# Altium project Amplificador.PrjPcb
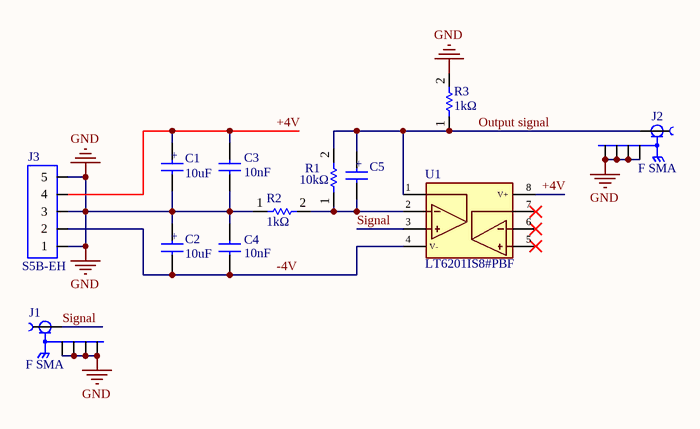
[diagram p0: Amplificador.SchDoc]
1 sheet, 12 parts. Net scope: global (net labels, ports and power ports of the same name join across sheets).
Board file: Amplificador.PcbDoc

## Sheet Amplificador.SchDoc
size A4; SheetNumber: 1; SheetTotal: 1

### Parts
C1  10uF  [WCAP-ATG5_5X11(DXL)]
C2  10uF  [WCAP-ATG5_5X11(DXL)]
C3  10nF  [CAPRR508W54L508T381H660]
C4  10nF  [CAPRR508W54L508T381H660]
C5  10uF  [WCAP-ATG5_5X11(DXL)]  (value not drawn)
J1  F SMA  [HUBER+SUHNER_85201239]
J2  F SMA  [HUBER+SUHNER_85201239]
J3  S5B-EH  [JST_S5B-EH]
R1  10kΩ  [RESAD1100W55L630D240B]
R2  1kΩ  [PCBComponent_1]
R3  1kΩ  [PCBComponent_1]
U1  LT6201IS8#PBF  [SOIC127P600X175-8N]

### Nets
GND: C1.2(NEG) C2.1(POS) C3.2(NEG) C4.1(POS) J1.G1 J1.G2 J1.G3 J1.G4 J2.G1 J2.G2 J2.G3 J2.G4 J3.1 J3.3 J3.5 R2.1 R3.2
+4V: C1.1(POS) C3.1(POS) J3.4 U1.8(V+)
-4V: C2.2(NEG) C4.2(NEG) J3.2 U1.4(V-)
Output signal: C5.1(POS) J2.1 R1.2 R3.1 U1.1(OUTA)
Signal: J1.1 U1.3(+INA)
NetC5_2: C5.2(NEG) R1.1 R2.2 U1.2(-INA)

Not connected (* = marked no-connect by the designer): U1 5(+INB)* 6(-INB)* 7(OUTB)*

### Notes on the sheet
- (in symbol WCAP-ATG5_5X11) +

### Library data of the parts
C1 C2 C5 = WCAP-ATG5_5X11: 10 µF 25 V Aluminum Electrolytic Capacitors Radial, Can 2000 Hrs @ 105°C; ID: 860020472003; ComponentLink1Description: Compra; ComponentLink1URL: https://www.digikey.com/en/products/detail/w%C3%BCrth-elektronik/860020472003/5727057
C3 C4 = C322C103K5R5TA: 10000 pF ±10% 50V Ceramic Capacitor X7R Radial; ID: C322C103K5R5TA; ComponentLink1Description: Compra; ComponentLink1URL: https://www.digikey.com/en/products/detail/kemet/C322C103K5R5TA/818102
J1 J2 = 85201239: SMA Connector Jack, Female Socket 50 Ohms Through Hole, Right Angle Solder; MF: HUBER+SUHNER; MP: 85_SMA-50-0-103/111_NE; SnapEDA_Link: https://www.snapeda.com/parts/85_SMA-50-0-103/111_NE/Huber%252BSuhner/view-part/?ref=snap; Package: None; Value: *; Check_prices: https://www.snapeda.com/parts/85_SMA-50-0-103/111_NE/Huber%252BSuhner/view-part/?ref=eda
J3 = S5B-EH: Connector Header Through Hole, Right Angle 5 position 0.098 (2.50mm); MF: JST Sales; SnapEDA_Link: https://www.snapeda.com/parts/S5B-EH/JST/view-part/?ref=snap; Package: None; Value: *; MP: S5B-EH; Check_prices: https://www.snapeda.com/parts/S5B-EH/JST/view-part/?ref=eda
R1 = 10KOhms: 10 kOhms ±1% 0.5W, 1/2W Through Hole Resistor Axial Metal Film; ID: MFR50SFTE52-10K; ComponentLink1Description: Compra; ComponentLink1URL: https://www.digikey.com/en/products/detail/yageo/MFR50SFTE52-10K/9151037
R2 R3 = MFR1WSFBE52-1K: 1 kOhms ±1% 1W Through Hole Resistor Axial Metal Film
U1 = LT6201IS8#PBF: Buffer Amplifier 2 Circuit Rail-to-Rail 8-SO; ID: LT6201IS8#PBF; ComponentLink1Description: Compra; ComponentLink1URL: https://www.digikey.com/en/products/detail/analog-devices-inc/LT6201IS8-PBF/961104